# EAGLE design RH064.1 (EAGLE 7.7.0)
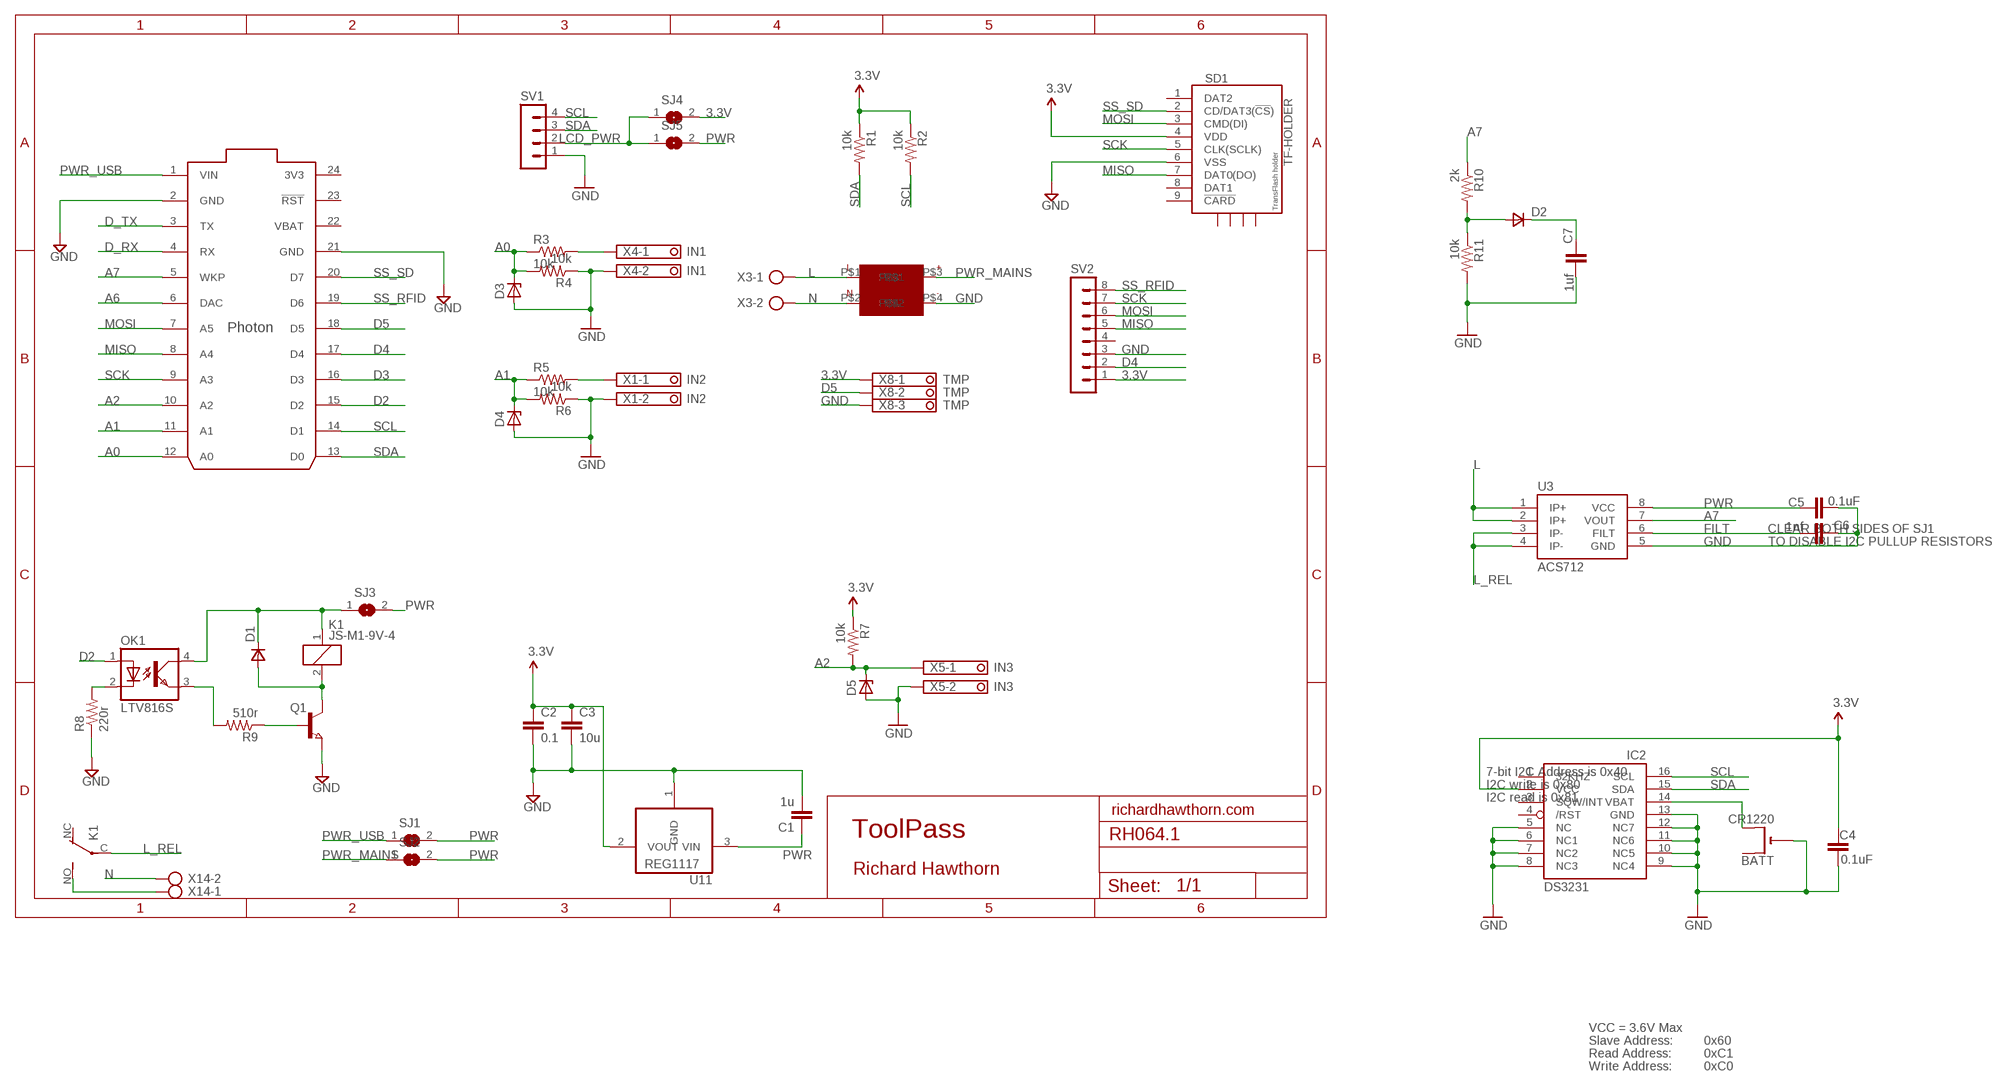
[diagram p0: schematic, sheet 1]

## Parts
BATT  CR1220  CR1220SMT  [CR1220-SMD]
C1  1u  CAP0603-CAP  [0603-CAP]
C2  0.1  CAP0603-CAP  [0603-CAP]
C3  10u  CAP0805-CAP  [0805-CAP]
C4  0.1uF  0.1UF-25V(+80/-20%)(0603)  [0603-CAP]
C5  0.1uF  0.1UF-25V(+80/-20%)(0603)  [0603-CAP]
C6  1nf  0.1UF-25V(+80/-20%)(0603)  [0603-CAP]
C7  1uf  0.1UF-25V(+80/-20%)(0603)  [0603-CAP]
D1  VAR2SOT23  [SOT-23]
D2  VAR2SOT23  [SOT-23]
D3  ZENER-DIODESOT23  [SOT23]
D4  ZENER-DIODESOT23  [SOT23]
D5  ZENER-DIODESOT23  [SOT23]
IC2  DS3231  DS3231/SO  [SO16W]
K1  JS-M1-9V-4  [JS-M]
OK1  LTV816S  [SMD4]
Q1  NPN-TRANSISTOR_SOT23  [SOT23]
R1  10k  RESISTOR0805-RES  [0805]
R2  10k  RESISTOR0805-RES  [0805]
R3  10k  RESISTOR0603-RES  [0603-RES]
R4  10k  RESISTOR0603-RES  [0603-RES]
R5  10k  RESISTOR0603-RES  [0603-RES]
R6  10k  RESISTOR0603-RES  [0603-RES]
R7  10k  RESISTOR0603-RES  [0603-RES]
R8  220r  RESISTOR0603-RES  [0603-RES]
R9  510r  RESISTOR0603-RES  [0603-RES]
R10  2k  RESISTOR0805-RES  [0805]
R11  10k  RESISTOR0805-RES  [0805]
SD1  TF-HOLDER  [TF-PULL]
SJ1  SJ  [SJ]
SJ2  SJ  [SJ]
SJ3  SJ  [SJ]
SJ4  SJ  [SJ]
SJ5  SJ  [SJ]
SV1  MA04-1  [MA04-1]
SV2  MA08-1  [MA08-1]
U1  PHOTON_SMD  [PHOTON_SMD]
U3  ACS712  [SO08]
U11  REG1117  [SOT223]
U$1  5VPWR  [5VPWR]
X1  IN2  1751248  [1751248]
X3  AK500/2  [AK500/2]
X4  IN1  1751248  [1751248]
X5  IN3  1751248  [1751248]
X8  TMP  1751251  [1751251]
X14  AK500/2  [AK500/2]

## Nets
3.3V: C2.1 C3.1 C4.1 IC2.2(VCC) R1.1 R2.1 R7.1 SD1.4(VDD) SJ4.2 SV2.1 U11.2(VOUT) X8.1
A0: D3.3(C) R3.1 R4.2 U1.12(A0)
A1: D4.3(C) R5.1 R6.2 U1.11(A1)
A2: D5.3(C) R7.2 U1.10(A2) X5.1
A6: U1.6(DAC)
A7: R10.1 U1.5(WKP) U3.7(VOUT)
D2: OK1.1(A) U1.15(D2)
D3: U1.16(D3)
D4: SV2.2 U1.17(D4)
D5: U1.18(D5) X8.2
D_RX: U1.4(RX)
D_TX: U1.3(TX)
FILT: C6.2 U3.6(FILT)
GND [power]: BATT.- C1.2 C2.2 C3.2 C4.2 C5.2 C6.1 C7.2 D3.1(A) D4.1(A) D5.1(A) IC2.5(NC) IC2.6(NC1) IC2.7(NC2) IC2.8(NC3) IC2.9(NC4) IC2.10(NC5) IC2.11(NC6) IC2.12(NC7) IC2.13(GND) Q1.2(E) R4.1 R6.1 R8.1 R11.2 SD1.6(VSS) SV1.1 SV2.3 U1.2(GND) U1.21(GND) U3.5(GND) U11.1(GND) U$1.P$4 X1.2 X4.2 X5.2 X8.3
L [mains]: U3.1(IP+) U3.2(IP+) U$1.P$1 X3.1
L_REL [mains]: K1.C(2:P) U3.3(IP-) U3.4(IP-)
LCD_PWR: SJ4.1 SJ5.1 SV1.2
MISO: SD1.7(DAT0(DO)) SV2.5 U1.8(A4)
MOSI: SD1.3(CMD(DI)) SV2.6 U1.7(A5)
N [mains]: U$1.P$2 X3.2 X14.2
N$2: OK1.3(EMIT) R9.2
N$3: R5.2 X1.1
N$4: OK1.2(C) R8.2
N$7 [mains]: K1.NO(2:S) X14.1
N$13: R3.2 X4.1
N$30: Q1.1(B) R9.1
N$31: D1.3(A) K1.2 Q1.3(C)
N$32: BATT.+$2(+1) IC2.14(VBAT)
N$34: D2.3(A) R10.2 R11.1
N$36: C7.1 D2.1(C)
PWR [power]: C1.1 C5.1 SJ1.2 SJ2.2 SJ3.2 SJ5.2 U3.8(VCC) U11.3(VIN)
PWR_MAINS: SJ2.1 U$1.P$3
PWR_USB [power]: SJ1.1 U1.1(VIN)
RL_PWR [power]: D1.1(C) K1.1 OK1.4(COL) SJ3.1
SCK: SD1.5(CLK(SCLK)) SV2.7 U1.9(A3)
SCL: IC2.16(SCL) R2.2 SV1.4 U1.14(D1)
SDA: IC2.15(SDA) R1.2 SV1.3 U1.13(D0)
SS_RFID: SV2.8 U1.19(D6)
SS_SD: SD1.2(CD/DAT3(!CS!)) U1.20(D7)
Unconnected: BATT.+$1(+) IC2.1(32KHZ) IC2.3(SQW/INT) IC2.4(/RST) K1.NC(2:O) SD1.1(DAT2) SD1.8(DAT1) SD1.9(!CARD) SD1.S1 SD1.S2 SD1.S3 SD1.S4 SV2.4 U1.23(!RST) U1.25(EN) U1.26(!SETUP) U1.27(RGB_RED) U1.28(RGB_GREEN) U1.29(RGB_BLUE) U1.30(USB_D-) U1.31(USB_D+)

## Notes on the sheet
- CLEAR BOTH SIDES OF SJ1
- TO DISABLE I2C PULLUP RESISTORS
- 7-bit I2C Address is 0x40
- I2C write is 0x80
- I2C read is 0x81
- richardhawthorn.com
- ToolPass
- Richard Hawthorn
- VCC = 3.6V Max
- Slave Address: | 0x60
- Read Address: | 0xC1
- Write Address: | 0xC0

## Power pins joined to a net without a drawn wire
3V3: U1.24(3V3)
VBAT: U1.22(VBAT)

## Library data of the parts
BATT = adafruit:CR1220: CR1216/CR1220/CR1225 12mm 3V lithium coin cell Great for battery packup. Both SMT and THM holders. Note the THM package has the ground pads on both sides of the PCB so that the masks are the same - this reduces the cost
C1-C3 = LowPowerLab:CAP: Capacitor Standard 0603 ceramic capacitor, and 0.1" leaded capacitor.
C4 C5 = SparkFun-Capacitors:0.1UF-25V(+80/-20%)(0603): Ceramic Standard decoupling cap CAP-00810; PROD_ID: CAP-00810
C6 C7 = SparkFun-Capacitors:0.1UF-25V(+80/-20%)(0603): Ceramic Standard decoupling cap CAP-00810; PROD_ID: CAP-00810; VALUE: 0.1uF
D1 D2 = zetex:VAR2SOT23: DIODE; OC_FARNELL: unknown; OC_NEWARK: unknown
D3-D5 = diode:ZENER-DIODE: Z-Diode
IC2 = adafruit:DS3231
K1 = relay:JS-M1*: Automotive Ultra-Miniature Power Relay NAiS Source: http://www.mew-europe.com/.. en_ds_61211_0000.pdf; OC_FARNELL: unknown; OC_NEWARK: unknown
OK1 = optocoupler:LTV816: OPTO COUPLER Source: LITEON, LTV816.pdf; OC_FARNELL: unknown; OC_NEWARK: unknown
Q1 = semicon-smd-ipc:NPN-TRANSISTOR_: NPN TRANSISTOR
R1 R2 R10 R11 = SparkFun:RESISTOR: Resistor Basic schematic elements and footprints for 0603, 1206, and PTH resistors.
R3-R9 = LowPowerLab:RESISTOR: Resistor Basic schematic elements and footprints for 0603, 1206, and PTH resistors.
SD1 = sd_mmc:TF-HOLDER: TF / Micro SD socket is PUSH-PUSH type, the card can be pushed into and auto locked and pushed out by simply press the card. Surface Mounting type.
SJ1-SJ5 = jumper:SJ: SMD solder JUMPER
SV1 = con-lstb:MA04-1: PIN HEADER; OC_FARNELL: unknown; OC_NEWARK: unknown
SV2 = con-lstb:MA08-1: PIN HEADER; OC_FARNELL: unknown; OC_NEWARK: unknown
U1 = Particle:PHOTON_SMD: Photon (without headers) - designed to be surface mounted with 7 extra exposed pads on the bottom of the board which include, 3 RGB LED outputs, /SETUP, EN (3.3V SMPS enable input), USB D+ and USB D-.
U3 = SparkFun:ACS712
U11 = burr-brown:REG1117: 800mA and 1A Low Dropout (LDO) Positive Regulator 1.8V, 2.5V, 2.85V, 3.3V, 5V, and Adj; MPN: REG1117; OC_FARNELL: 1097566; OC_NEWARK: 14P6981
U$1 = Richards:5VPWR
X1 X4 X5 = con-phoenix-350:1751248: MKDS 1/ 2-3,5 Printklemme Nennstrom: 10 A Bemessungsspannung: 160 V Raster: 3,5 mm Polzahl: 2 Montageart: Löten Anschlussart: Schraubanschluss Anschlussrichtung vom Leiter zur Platine: 0° Source: http://eshop.phoenixcontact.com .. 1751248.pdf; OC_FARNELL: unknown; OC_NEWARK: unknown
X3 X14 = con-ptr500:AK500/2: CONNECTOR; OC_FARNELL: unknown; OC_NEWARK: unknown
X8 = con-phoenix-350:1751251: MKDS 1/ 3-3,5 Printklemme Nennstrom: 10 A Bemessungsspannung: 160 V Raster: 3,5 mm Polzahl: 3 Montageart: Löten Anschlussart: Schraubanschluss Anschlussrichtung vom Leiter zur Platine: 0° Source: http://eshop.phoenixcontact.com .. 1751251.pdf; OC_FARNELL: unknown; OC_NEWARK: unknown

## Net classes
1 power: width 0.381 mm, clearance 0.254 mm
2 mains: width 3.048 mm

## Board
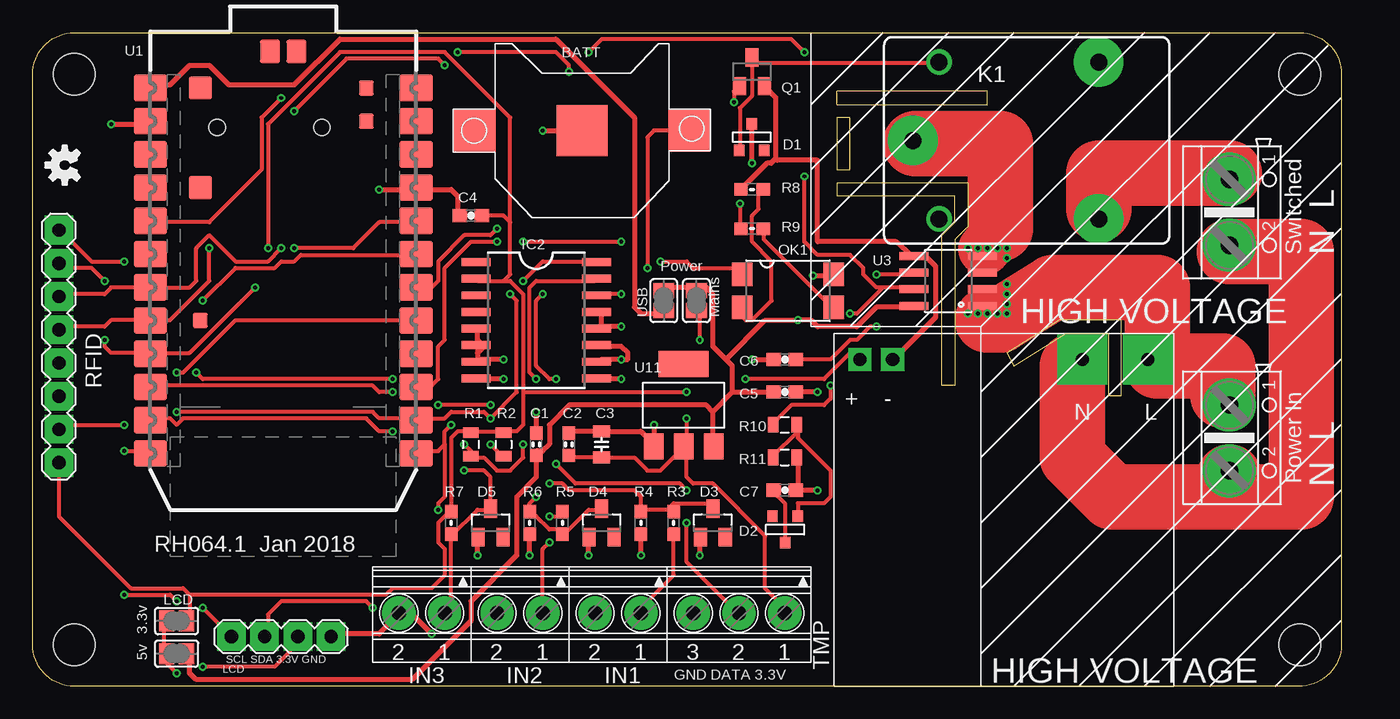
[diagram p1: board, top side]
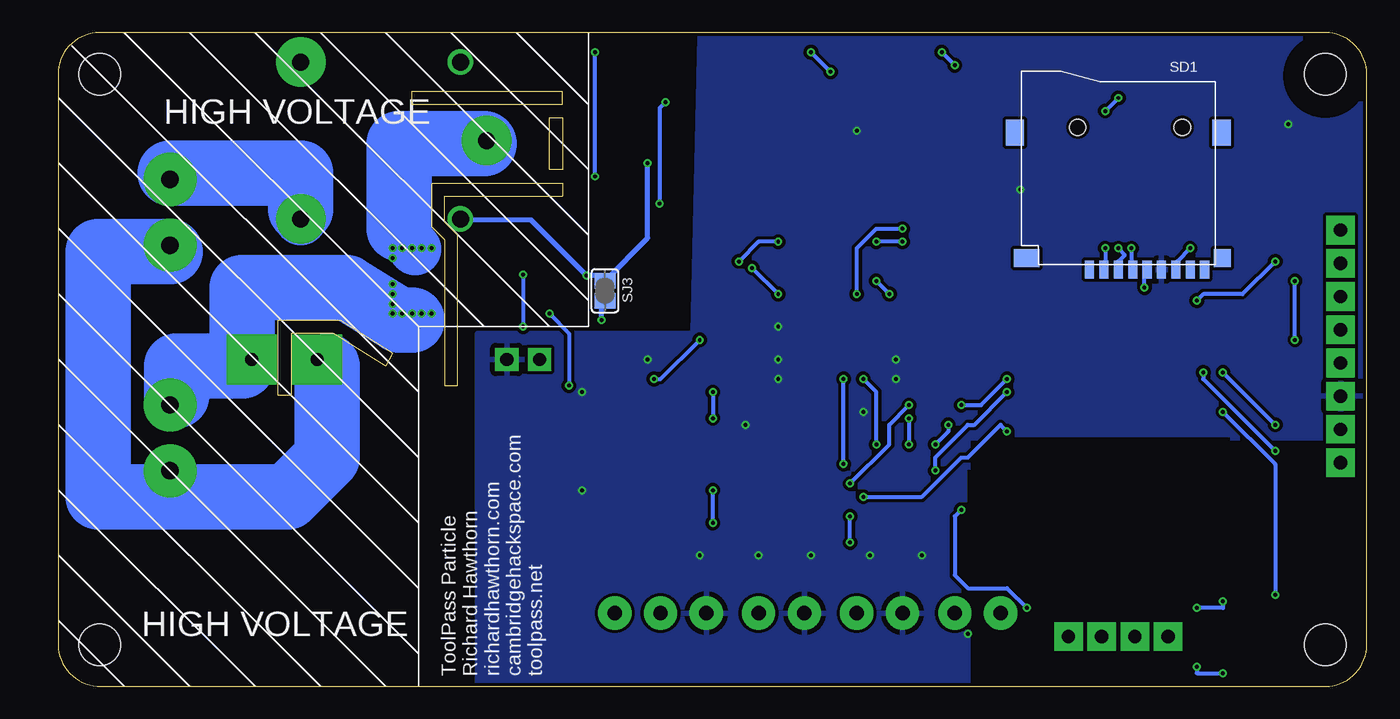
[diagram p2: board, bottom side, seen from below]

Size 100.06 x 49.99 mm. Coordinates in mm from the lower left corner, seen from the top.
Outline: 0,3.17 0,46.81 arc-90 3.17,49.99 96.89,49.99 arc-90 100.06,46.81 100.06,3.17 arc-90 96.76,0 3.17,0 arc-90 0,3.17
Outline: 71.5,38.5 61.5,38.5 61.5,37.5 70.5,37.5 70.5,35.5 69.5,34.5 69.5,23 70.5,23 70.5,34.15 71.5,35.15 71.5,38.5
Outline: 61.5,44.5 73,44.5 73,45.5 61.5,45.5 61.5,44.5
Outline: 78.5,28 74.5,25.5 75,24.5 79,27 82.25,27 82.25,22.25 83.25,22.25 83.25,28 78.5,28
Outline: 61.5,43.5 61.5,39.5 62.5,39.5 62.5,43.5 61.5,43.5
Copper layers (1*16): Top 0.035mm / dielectric 1.5mm / Bottom 0.035mm
Design rules "ITEADstudio_DRC *": minimum track width 12mil, minimum drill 12mil, track to track 6mil, track to pad 6mil, pad to pad 6mil, via to via 6mil, smd to smd 0mil, copper to edge 10mil, drill to drill 10mil, minimum pad ring 10mil, minimum via ring 6mil, stop-mask expansion 2mil, vias tented up to drill 100mil, thermal gap 15mil
Holes 3.2 mm at 3.17,3.17 96.89,3.17 3.17,46.81 96.89,46.81
tRestrict: area 93.9,43.8 to 99.9,49.8; area 93.9,0.2 to 99.9,6.2; area 0.2,0.2 to 6.2,6.2; area 7.5,8 to 30.5,19; area 0.2,43.7 to 6.2,49.7; 1 lines
bRestrict: area 0.2,0.2 to 6.2,6.2; area 93.9,43.8 to 99.9,49.8; area 93.9,0.2 to 99.9,6.2; area 7.5,8 to 30.5,19; area 0.2,43.7 to 6.2,49.7

### Footprints (pad centres in the part's own frame; a part is rotated, then mirrored left to right if it is on the bottom)
CR1220-SMD = smd 3.2 x 3.2: +$1 -8.2,0; +$2 8.2,0 | smd 3.9 x 3.9: - 0,0
0603-CAP = smd 1.016 x 0.965: 1 -0.85,0; 2 0.85,0
0805-CAP = smd 0.902 x 1.3: 1 -1,0; 2 1,0
0603-CAP' = smd 1.1 x 1: 1 -0.85,0; 2 0.85,0
SOT-23 = smd 0.787 x 0.889: 1 0.025,-1.016; 2 -0.94,1.016; 3 0.991,1.016
SOT23 = smd 1 x 1.4: 1 -0.95,-1.1; 2 0.95,-1.1; 3 0,1.1
SO16W = smd 0.6 x 2.2: 1 -4.445,-4.6; 2 -3.175,-4.6; 3 -1.905,-4.6; 4 -0.635,-4.6; 5 0.635,-4.6; 6 1.905,-4.6; 7 3.175,-4.6; 8 4.445,-4.6; 9 4.445,4.6; 10 3.175,4.6; 11 1.905,4.6; 12 0.635,4.6; 13 -0.635,4.6; 14 -1.905,4.6; 15 -3.175,4.6; 16 -4.445,4.6
JS-M = drill 1.3: 1 6.7,6; 2 6.7,-6 | drill 1.3 pad 3.81: C 8.7,0; NC -5.5,-6; NO -5.5,6
SMD4 = smd 1.78 x 1.55: 1 -1.27,-3.5; 2 1.27,-3.5; 3 1.27,3.5; 4 -1.27,3.5
0805 = smd 0.8 x 1.2: 1 -0.9,0; 2 0.9,0
0603-RES = smd 1.016 x 0.965: 1 -0.85,0; 2 0.85,0
TF-PULL = smd 0.7 x 1.4: 1 -2.2,-7.62; 2 -1.1,-7.62; 3 0,-7.62; 4 1.1,-7.62; 5 2.2,-7.62; 6 3.3,-7.62; 7 4.4,-7.62; 8 5.5,-7.62; 9 6.6,-7.62 | smd 1.4 x 2: S1 -7.9,2.85; S2 7.9,2.85 | smd 1.28 x 1.4: S3 7.96,-6.75 | smd 1.95 x 1.4: S4 -7.025,-6.75 | hole 1.25: -3.1,3.25; 4.9,3.25
SJ = smd 1.168 x 1.6: 1 -0.762,0; 2 0.762,0
MA04-1 = drill 1.016 pad 2.184 square: 1 -3.81,0; 2 -1.27,0; 3 1.27,0; 4 3.81,0
MA08-1 = drill 1.016 pad 2.184 square: 1 -8.89,0; 2 -6.35,0; 3 -3.81,0; 4 -1.27,0; 5 1.27,0; 6 3.81,0; 7 6.35,0; 8 8.89,0
PHOTON_SMD = smd 2.54 x 2.032: 1 0,32.258; 2 0,29.718; 3 0,27.178; 4 0,24.638; 5 0,22.098; 6 0,19.558; 7 0,17.018; 8 0,14.478; 9 0,11.938; 10 0,9.398; 11 0,6.858; 12 0,4.318; 13 20.32,4.318; 14 20.32,6.858; 15 20.32,9.398; 16 20.32,11.938; 17 20.32,14.478; 18 20.32,17.018; 19 20.32,19.558; 20 20.32,22.098; 21 20.32,24.638; 22 20.32,27.178; 23 20.32,29.718; 24 20.32,32.258 | smd 1.778 x 1.778: 25 3.81,32.258; 26 3.81,24.638 | smd 1.143 x 1.143: 27 3.81,14.478; 28 16.51,29.718; 29 16.51,32.258 | smd 1.524 x 1.778: 30 11.176,35.052; 31 9.144,35.052
SO08 = smd 0.61 x 2.21: 1 -1.905,-2.616; 2 -0.635,-2.616; 3 0.635,-2.616; 4 1.905,-2.616; 5 1.905,2.616; 6 0.635,2.616; 7 -0.635,2.616; 8 -1.905,2.616
SOT223 = smd 1.499 x 2.007: 1 -2.261,-3.15; 2 0.025,-3.15; 3 2.311,-3.15 | smd 3.81 x 2.007: 4 0,3.15
5VPWR = drill 1 pad 3.81 square: P$1 2,2; P$2 7,2 | drill 1 pad 1.778 square: P$3 24,2; P$4 21.5,2
1751248 = drill 1.1 pad 2.54: 1 -1.75,-0.1; 2 1.75,-0.1
AK500/2 = drill 1.321 pad 4.064: 1 -2.515,0; 2 2.515,0
1751251 = drill 1.1 pad 2.54: 1 -3.5,-0.1; 2 0,-0.1; 3 3.5,-0.1

### Placement (x,y rotation side)
BATT  42,42.5 0 top
C1  38.5,18.5 90 top
C2  41,18.5 90 top
C3  43.5,18.5 90 top
C4  0.1uF  [0603-CAP']  33.5,36 180 top
C5  0.1uF  [0603-CAP']  57.5,22.5 0 top
C6  1nf  [0603-CAP']  57.5,25 0 top
C7  1uf  [0603-CAP']  57.5,15 0 top
D1  55,42 180 top
D2  57.5,12 0 top
D3  52,12.5 0 top
D4  43.5,12.5 0 top
D5  35,12.5 0 top
IC2  38.5,28 270 top
K1  76,41.75 180 top
OK1  57.75,30.25 270 top
Q1  55,47 0 top
R1  33.5,18.5 270 top
R2  36,18.5 270 top
R3  49,12.5 270 top
R4  46.5,12.5 90 top
R5  40.5,12.5 90 top
R6  38,12.5 90 top
R7  32,12.5 270 top
R8  55,38 0 top
R9  55,35 0 top
R10  57.5,20 0 top
R11  57.5,17.5 0 top
SD1  19,39.5 0 bottom
SJ1  48.25,29.5 90 top
SJ2  50.75,29.5 90 top
SJ3  58.25,30.25 270 bottom
SJ4  11,5 0 top
SJ5  11,2.5 0 top
SV1  19,3.8 180 top
SV2  2,26 90 top
U1  9,13.5 0 top
U3  70,31 90 top
U11  49.75,21.5 0 top
U$1  87.25,27 180 top
U$3  [OSHW-LOGO-S]  2.45,39.85 90 top
X1  37.25,5.5 180 top
X3  91.5,19 270 top
X4  44.75,5.5 180 top
X5  29.75,5.5 180 top
X8  54,5.5 180 top
X14  91.5,36.25 270 top

### Tracks (layer width: path | path; a pad name or v marks a point on that pad's centre or on a via)
3.3V  (via drill 0.3)
  Top 0.305: C2.1 41,17.5 C3.1 46,17.5 47,16.5 48,16.5 49.5,18 U11.2 | U11.2 50,18 50,16 50.5,15.5 52,15.5 56,11.5 56,7.5 57.5,6 X8.1 | 12,7 12,5 SJ4.2 | 12,7 11.5,7.5 7.5,7.5 2,13 SV2.1 | 32,13.5 32,19 32.5,19.5 33.5,19.5 | 33.5,19.5 36,19.5 | 33.5,19.5 R1.1 | C4.1 36,36 36.5,35.5 | 36.5,35.5 36.5,31.5 36,31 | 36,31 34,31 IC2.2 | v18,33.5 18,43 23.5,48.5 31.5,48.5 36.5,43.5 36.5,35.5 | 36,19.5 37,19.5 37.5,20 37.5,22.5 | 37.5,22.5 37.5,30 36.5,31 36,31 | 36,19.5 R2.1 | 12,7 27,7 27.5,7.5 30.5,7.5 31.5,8.5 31.5,10.5 31,11 31,12.5 32,13.5 | 32,13.5 R7.1 | v50,20.5 50,18.5 U11.2 | 37.5,22.5 v50,22.5
  Bottom 0.305: v18,33.5 18,32 SD1.4 | v50,22.5 v50,20.5
A0  (via drill 0.3)
  Top 0.305: 48.5,13.5 49,13.5 R3.1 | 48.5,13.5 46.5,13.5 | 48.5,13.5 49,14 52,14 D3.3 | v7,18 9,18 U1.12 | v12.5,24 13,23.5 v27.5,23.5 | v35,21.5 v31,21.5 | v39.5,15.5 40.5,15.5 41,15 46,15 46.5,14.5 46.5,13.5 | 46.5,13.5 R4.2
  Bottom 0.305: v7,18 12.5,23.5 v12.5,24 | v27.5,23.5 29.5,21.5 v31,21.5 | v35,21.5 36.5,20 36.5,18.5 v39.5,15.5
A1  (via drill 0.3)
  Top 0.305: D4.3 43.5,13.5 42.5,13.5 40.5,11.5 R5.1 40.5,12 39.5,12 38.5,13 38,13 R6.2 38,14 v38.5,14.5 | v27.5,19.5 26.5,19.5 25.5,20.5 11.5,20.5 11,20 10.5,20.5 9,20.5 U1.11
  Bottom 0.305: v27.5,19.5 28,20 30.5,17.5 31,17.5 34,14.5 v38.5,14.5
A2  (via drill 0.3)
  Top 0.305: 32,11.5 32,6.5 31.5,6 X5.1 | 32,11.5 34,13.5 35,13.5 D5.3 35,16 34.5,16.5 v33,16.5 | 32,11.5 R7.2 | v27.5,22.5 26.5,22.5 26,23 9,23 U1.10
  Bottom 0.305: v27.5,22.5 30,20 30.5,20 33,17.5 v33,16.5
A7  (via drill 0.3)
  Top 0.305: v61,23 61,22 60.5,21.5 58,21.5 56.5,20 R10.1 | v62.5,28.5 63,28.5 65,30.5 | 65,30.5 67,30.5 U3.7 | v19,45 17.5,43.5 17.5,39.5 13.5,35.5 9,35.5 U1.5 | v20,44 24,48 31,48 v31.5,47.5 | v32.5,48.5 40,48.5 41,47.5 v41,47 | v42.5,48.5 43.5,49.5 58,49.5 v59,48.5 | v59,39 59,34 60,33 62.5,33 63.5,32 63.5,31.5 64.5,30.5 65,30.5
  Bottom 0.305: v61,23 61,27 v62.5,28.5 | v20,44 v19,45 | v32.5,48.5 v31.5,47.5 | v42.5,48.5 v41,47 | v59,39 v59,48.5
D2  (via drill 0.3)
  Top 0.305: v48,32.5 50,32.5 50.5,32 54,32 OK1.1 | v37.5,34 v45,34 | v35.5,34 33.5,34 31.5,32 31.5,26.5 31,26 31,23.5 30.5,23 29.5,23 U1.15
  Bottom 0.305: v48,32.5 46.5,34 v45,34 | v35.5,34 v37.5,34
D4  (via drill 0.3)
  Top 0.305: v11,24 11.5,24 15.5,28 29,28 U1.17 | v7,20 2,20 SV2.2
  Bottom 0.305: v7,20 v11,24
D5  (via drill 0.3)
  Top 0.305: v35.5,35 35,34.5 33,34.5 31,32.5 31,31 30.5,30.5 29.5,30.5 U1.18 | v39,30 38.5,29.5 38.5,24.5 39.5,23.5 v40,23.5 | v40,17 41.5,15.5 49.5,15.5 v50,15 | v50,12.5 50,9.5 54,5.5 X8.2
  Bottom 0.305: v35.5,35 37.5,35 39,33.5 v39,30 | v40,17 v40,23.5 | v50,12.5 v50,15
FILT  (via drill 0.3)
  Top 0.305: C6.2 61,25 62.5,26.5 63,26.5 64,27.5 v64.5,27.5 | v64.5,31.5 67,31.5 U3.6
  Bottom 0.305: v64.5,31.5 v64.5,27.5
GND  (via drill 0.3)
  Top 0.381: 56.81,40.35 56.46,40.01 56.12,40.01 54.18,38.06 R8.1 | 56.81,40.35 56.81,45.03 56.01,45.83 Q1.2 | U$1.P$4 65.84,25.03 69.04,28.23 69.04,32.12 68.35,32.8 67.44,32.8 U3.5 67.21,32.92 66,34 60,34 60,40.23 56.92,40.23 56.81,40.35 | 28,5.5 26.5,4 23,4 SV1.1 | C2.2 41,19.5 C3.2 46.5,19.5 47,19 47,18.5 U11.1 47.5,18.5 v47.5,20 | C4.2 32.5,36 32.5,37.5 32,38 29.5,38 U1.21 29,38 v26.5,38 | 34,25.5 34,26 IC2.6 | 34,25.5 34,25 | 34,25.5 34.5,26 34,26.5 34,27.5 IC2.5 | 58.5,15 58.5,17.5 R11.2 | v38,10 R6.1 | v46.5,10 R4.1 | v38.5,21 C1.2 | v60,22.5 C5.2 | v55,25 C6.1 | v34,10 34,11 D5.1 | v42.5,10 42.5,11 D4.1 | v51,10 51,11 D3.1 | v60,15 58.5,15 | 58.5,15 C7.2 | v36,23.5 34,23.5 IC2.8 | v45,23.5 43.5,23.5 IC2.9 | IC2.10 43.5,25 v45,25 45.5,25 45.5,25.5 45,26 43.5,26 IC2.11 | v45,27.5 43.5,27.5 | 43.5,27.5 43.5,28.5 IC2.13 | 43.5,27.5 IC2.12 | v6,43 9,43 U1.2 | v36,25 34,25 | 34,25 IC2.7 | v39,42.5 BATT.- | 28,5.5 29,5.5 v30.5,4 | 28,5.5 X5.2
  pour Bottom: 0,49.75 0,19 30.5,19 30.5,0 68,0 68,27 51.5,27 51,49.75
L
  Top 0.5: U3.2 U3.1
  Top 0.813: U3.1 85.25,29.09 U$1.P$1
  Bottom 3: 86,24.5 85.5,25 U$1.P$1 85.5,25.25 85.5,25.5 86,26 | 91,24.5 91.5,24
  Bottom 4: 91.5,24 X3.1
  Bottom 5: 86,24.5 91,24.5 | 86,26 86,30.5 78,30.5 74,28 73,28
L_REL
  Top 0.5: U3.3 U3.4
  Top 0.813: K1.C 72.62,41.75 U3.4
LCD_PWR  (via drill 0.3)
  Top 0.305: 10,2.5 10,5 SJ4.1 | 10,2.5 10,2 v11,1 | v13,1.5 18.5,1.5 20.5,3.5 SV1.2 | 10,2.5 SJ5.1
  Bottom 0.305: v11,1 13,1 v13,1.5
MISO  (via drill 0.3)
  Top 0.305: v13.5,33.5 13.5,31 10.5,28 9,28 | 9,28 6,28 5.5,27.5 2,27.5 SV2.5 | 9,28 U1.8
  Bottom 0.305: v13.5,33.5 14.5,32.5 14.5,32 SD1.7
MOSI  (via drill 0.3)
  Top 0.305: v19,33.5 18,32.5 15.5,32.5 13.5,34.5 12.5,33.5 12.5,31 12,30.5 9,30.5 | 9,30.5 6,30.5 5.5,30 2,30 SV2.6 | 9,30.5 U1.7
  Bottom 0.305: SD1.3 19,32.5 18.5,33 v19,33.5
N
  Bottom 3: X3.2 91.5,14.5 | 79.5,24.5 U$1.P$2 | X14.2 91.5,33.25
  Bottom 5: 79.5,24.5 79.5,17.5 82.5,14.5 91.5,14.5 97,14.5 97,33.25 91.5,33.25
N$1
  Top 5: 91.5,39.25 81.5,39.25 81.5,36.5
N$2
  Top 0.305: R9.2 55.89,34.98 55.89,34.18 61.15,28.92 OK1.3
N$3  (via drill 0.3)
  Top 0.305: v39.5,13 40.5,13 R5.2 | v39.5,11 39,10.5 X1.1
  Bottom 0.305: v39.5,11 v39.5,13
N$4
  Top 0.305: R8.2 55.5,38 55.5,36.5 55,36 55,34 56.5,32.5 56.5,29.5 55,28 54.5,28 54,28.5 OK1.2
N$5
  Top 5: 86,24.5 91,24.5 91,22.25
N$6
  Top 5: 79.5,24.5 79.5,17.5 82.5,14.5 91.5,14.5 | 91.5,14.5 97,14.5 97,33.25 91.5,33.25 | 91.5,14.5 91.5,16
N$7
  Bottom 3: 91.5,39.25 X14.1
  Bottom 4: K1.NO 81.5,36.5 | 81.5,39 81.5,39.25
  Bottom 5: 81.5,39.25 91.5,39.25 | 81.5,39 81.5,36.5
N$8
  Top 5: 86,25 86,30.5 78,30.5 74,28 73,28
N$9
  Bottom 5: 91,22.25 91,22.5
N$11
  Top 4: 74,35 72.75,33.45
  Top 5: 67.5,41.5 74,41.5 74,35
N$13
  Top 0.305: R3.2 49,8.5 46.5,6 X4.1
N$16
  Bottom 4: 74,35 72.75,33.45
  Bottom 5: 67.5,41.5 74,41.5 74,35
N$17  (via drill 0.3)
  other vias: 71.5,28.5
N$18  (via drill 0.3)
  other vias: 72.25,28.5
N$19  (via drill 0.3)
  other vias: 73,28.5
N$22  (via drill 0.3)
  Bottom 0.381: v74.5,28.5 v73.75,28.5
N$23  (via drill 0.3)
  other vias: 74.5,29.25
N$24  (via drill 0.3)
  Bottom 0.381: v74.5,30.75 v74.5,30
N$25  (via drill 0.3)
  other vias: 71.5,33.5
N$26  (via drill 0.3)
  other vias: 72.25,33.5
N$27  (via drill 0.3)
  other vias: 73,33.5
N$28  (via drill 0.3)
  Bottom 0.381: v73.75,33.5 v74.5,33.5 v74.5,32.75
N$30  (via drill 0.3)
  Top 0.305: v54.06,36.92 54.06,35.09 R9.1 | v53.61,44.69 53.61,45.49 53.95,45.83 Q1.1
  Bottom 0.305: v54.06,36.92 54.06,44.23 v53.61,44.69
N$31
  Top 0.305: D1.3 54.06,41.03 54.06,44.23 54.98,45.15 54.98,48.01 Q1.3 55.09,47.66 69.27,47.66 K1.2
N$32  (via drill 0.3)
  Top 0.305: v45,30 43.5,30 IC2.14 | v47,32 47,42 47.5,42.5 BATT.+$2
  Bottom 0.305: v47,32 v45,30
N$34
  Top 0.305: 58.5,19.5 58.5,20 R10.2 58.5,19.5 | 58.5,19.5 58.5,19 61,16.5 61,14.5 60.5,14 58.5,14 58.5,13 D2.3 | 58.5,19.5 56.5,17.5 R11.1
N$36
  Top 0.305: D2.1 57.5,11 57.5,14 56.5,15 C7.1
PWR  (via drill 0.3)
  Top 0.381: U3.8 67,29 64.5,29 63,27.5 60,27.5 59.5,28 v58.5,28 56,28 53,25 | SJ1.2 48.5,30.5 50.5,30.5 SJ2.2 51,30.5 51.5,30.5 52,30 52,26 53,25 | 52,21 51.5,21.5 41,21.5 39.5,20 39.5,18.5 39,18 38.5,18 C1.1 38.5,16 37,14.5 37,10 33.5,6.5 33.5,5 29,0.5 12.5,0.5 12,1 12,2.5 SJ5.2 | 52,21 52,18.5 U11.3 | 53.5,22.5 C5.1 | 52,21 53.5,22.5 | 53,25 53.5,24.5 53.5,22.5
  Bottom 0.381: v58.5,28 58.5,29 SJ3.2
PWR_MAINS  (via drill 0.3)
  Top 0.305: v51,26.5 51,28.5 SJ2.1 | v54.5,23.5 60.5,23.5 62.5,25.5 63,25 U$1.P$3
  Bottom 0.305: v51,26.5 54,23.5 v54.5,23.5
PWR_USB
  Top 0.381: SJ1.1 48,28.5 46.5,28.5 46,29 46,43.5 40,49.5 23.5,49.5 20,46 15,46 13.5,47.5 12,47.5 10.5,46 9,46 U1.1
RL_PWR  (via drill 0.3)
  Top 0.381: v54.98,40.01 54.98,42.98 D1.1 | v59.66,31.43 61.15,31.43 OK1.4
  Bottom 0.381: v54.98,40.01 54.98,34.29 58.18,31.09 SJ3.1 58.41,31.09 58.75,31.43 v59.66,31.43 63.89,35.66 69.27,35.66 K1.1
SCK  (via drill 0.3)
  Top 0.305: v17,30.5 12,25.5 9,25.5 | v5.5,31 4.5,32 2,32 SV2.7 | v5.5,26.5 5.5,26 6,25.5 9,25.5 | 9,25.5 U1.9
  Bottom 0.305: v17,30.5 17,31.5 SD1.5 | v5.5,26.5 v5.5,31
SCL  (via drill 0.3)
  Top 0.305: v35,18.5 36,17.5 R2.2 | v37.5,31 39,32.5 43,32.5 IC2.16 | v36.5,30 37,29.5 37,22.5 v35,20.5 34.5,21 32,21 31.5,20.5 29.5,20.5 U1.14 29,20.5 26.5,20.5 26,21 v11,21 | v13,6 15,4 SV1.4 | v11,6.5 10.5,7 v7,7
  Bottom 0.305: v35,20.5 v35,18.5 | v36.5,30 v37.5,31 | v13,6 11,6 v11,6.5 | v7,7 7,17 v11,21
SDA  (via drill 0.3)
  Top 0.305: v33,18.5 33.5,18 R1.2 33.5,17.5 34.5,17.5 35.5,16.5 36.5,16.5 37.5,17.5 v37.5,18.5 | v32,20 31.5,19.5 31.5,18.5 | 31.5,18.5 31,18 29.5,18 U1.13 | v38.5,23.5 38,24 38,30.5 38.5,31 43,31 IC2.15 | v26,6 25.5,6.5 19,6.5 18,5.5 18,4 SV1.3 | v31,13.5 31,14 31.5,14.5 31.5,18.5
  Bottom 0.305: v33,18.5 32,19.5 v32,20 | v38.5,23.5 37.5,22.5 v37.5,18.5 | v26,6 27.5,7.5 30.5,7.5 31.5,8.5 31.5,13 v31,13.5
SS_RFID  (via drill 0.3)
  Top 0.305: v13,29.5 15.5,32 18.5,32 19,32.5 20,32.5 20.5,33 29,33 U1.19 | v7,32.5 4.5,32.5 2,35 SV2.8
  Bottom 0.305: v13,29.5 12.5,30 9.5,30 v7,32.5
SS_SD  (via drill 0.3)
  Top 0.305: v20,33.5 24.5,33.5 26.5,35.5 29,35.5 U1.20
  Bottom 0.305: v20,33.5 20,32 SD1.2

### Text on the board
tPlace: Switched | N L | HIGH VOLTAGE | Power In | N L | HIGH VOLTAGE
bPlace: HIGH VOLTAGE | HIGH VOLTAGE
tNames: Power | USB | Mains | RFID | RH064.1 Jan 2018 | LCD | 3.3v | 5v | SCL SDA 3.3V GND | LCD | GND DATA 3.3V
bNames: ToolPass Particle / Richard Hawthorn / richardhawthorn.com / cambridgehackspace.com / toolpass.net
tDocu: REG